# EAGLE design ov2640_module_v2 (EAGLE 5.06)
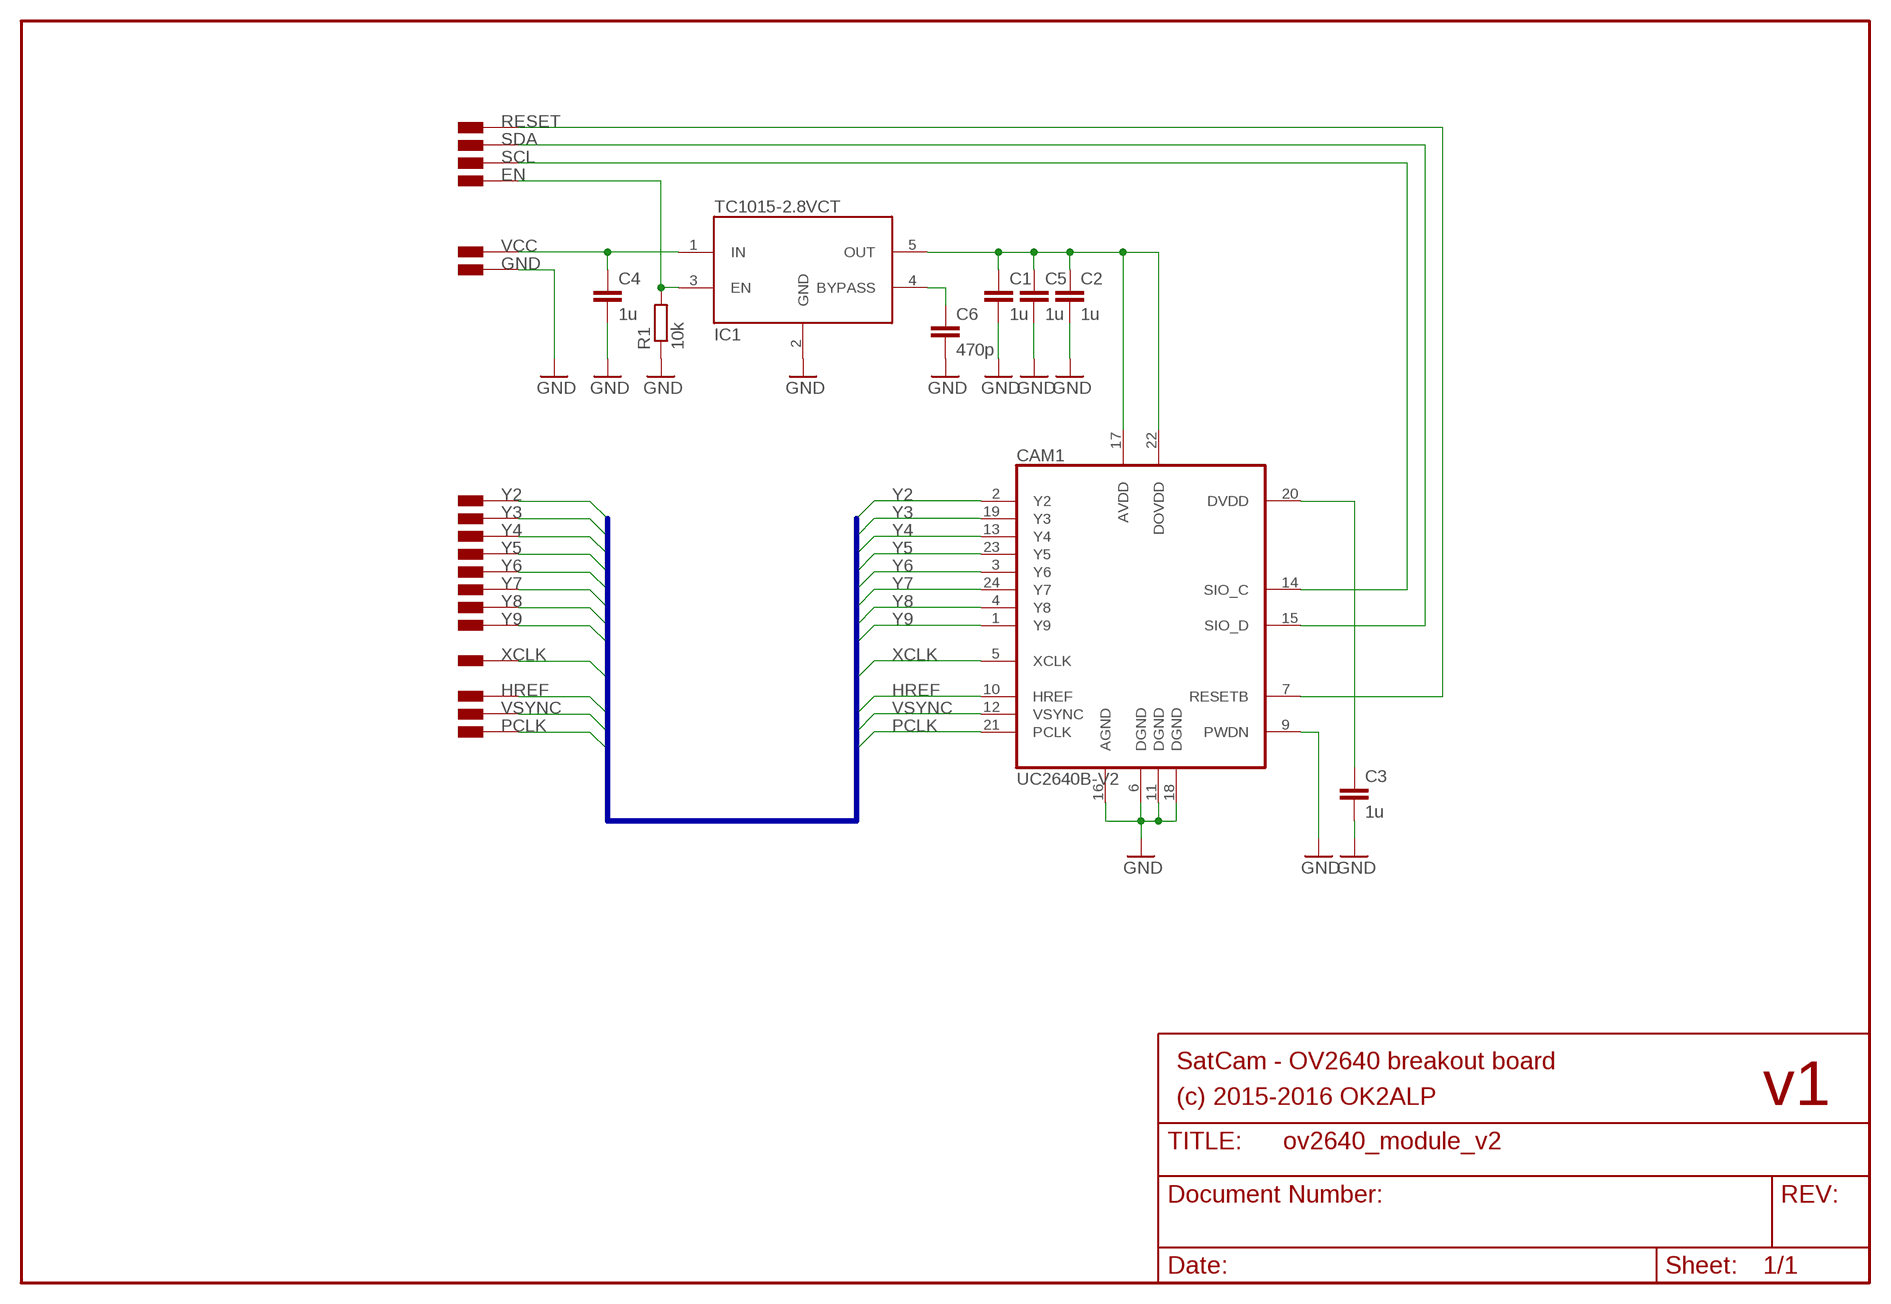
[diagram p0: schematic, sheet 1]

## Parts
C1  1u  C-EUC0603  [C0603]
C2  1u  C-EUC0603  [C0603]
C3  1u  C-EUC0603  [C0603]
C4  1u  C-EUC0603  [C0603]
C5  1u  C-EUC0603  [C0603]
C6  470p  C-EUC0603  [C0603]
CAM1  UC2640B-V2  [UC2640B2]
IC1  TC1015-2.8VCT  TC1015  [SOT23-5]
R1  10k  R-EU_R0603  [R0603]
X1  PIN-1.27-2  [PIN-1.27-2]
X2  PIN-1.27-2  [PIN-1.27-2]
X3  PIN-1.27-2  [PIN-1.27-2]
X4  PIN-1.27-2  [PIN-1.27-2]
X5  PIN-1.27-2  [PIN-1.27-2]
X6  PIN-1.27-2  [PIN-1.27-2]
X7  PIN-1.27-2  [PIN-1.27-2]
X8  PIN-1.27-2  [PIN-1.27-2]
X9  PIN-1.27-2  [PIN-1.27-2]
X10  PIN-1.27-2  [PIN-1.27-2]
X11  PIN-1.27-2  [PIN-1.27-2]
X12  PIN-1.27-2  [PIN-1.27-2]
X13  PIN-1.27-2  [PIN-1.27-2]
X14  PIN-1.27-2  [PIN-1.27-2]
X15  PIN-1.27-2  [PIN-1.27-2]
X16  PIN-1.27-2  [PIN-1.27-2]
X17  PIN-1.27-2  [PIN-1.27-2]
X20  PIN-1.27-2  [PIN-1.27-2]

## Nets
EN: IC1.3(EN) R1.2 X4.1
GND: C1.2 C2.2 C3.2 C4.2 C5.2 C6.2 CAM1.6(DGND) CAM1.9(PWDN) CAM1.11(DGND) CAM1.16(AGND) CAM1.18(DGND) IC1.2(GND) R1.1 X20.1
HREF: CAM1.10(HREF) X15.1
N$2: C3.1 CAM1.20(DVDD)
N$4: C6.1 IC1.4(BYPASS)
PCLK: CAM1.21(PCLK) X17.1
RESET: CAM1.7(RESETB) X1.1
SCL: CAM1.14(SIO_C) X3.1
SDA: CAM1.15(SIO_D) X2.1
VCAM: C1.1 C2.1 C5.1 CAM1.17(AVDD) CAM1.22(DOVDD) IC1.5(OUT)
VCC: C4.1 IC1.1(IN) X5.1
VSYNC: CAM1.12(VSYNC) X16.1
XCLK: CAM1.5(XCLK) X14.1
Y2: CAM1.2(Y2) X6.1
Y3: CAM1.19(Y3) X7.1
Y4: CAM1.13(Y4) X8.1
Y5: CAM1.23(Y5) X9.1
Y6: CAM1.3(Y6) X10.1
Y7: CAM1.24(Y7) X11.1
Y8: CAM1.4(Y8) X12.1
Y9: CAM1.1(Y9) X13.1

## Buses
Y[2..9],XCLK,HREF,VSYNC,PCLK

## Notes on the sheet
- SatCam - OV2640 breakout board
- (c) 2015-2016 OK2ALP | v1

## Library data of the parts
C1-C6 = rcl:C-EU: CAPACITOR, European symbol
CAM1 = satcam:UC2640B
IC1 = satcam:TC1015
R1 = rcl:R-EU_: RESISTOR, European symbol
X1-X17 X20 = satcam:PIN

## Board
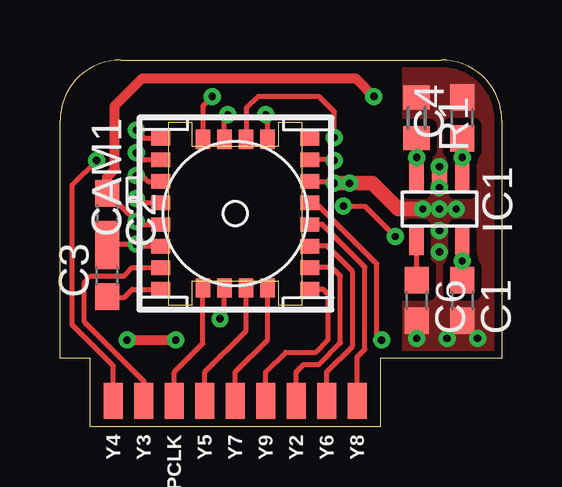
[diagram p1: board, top side]
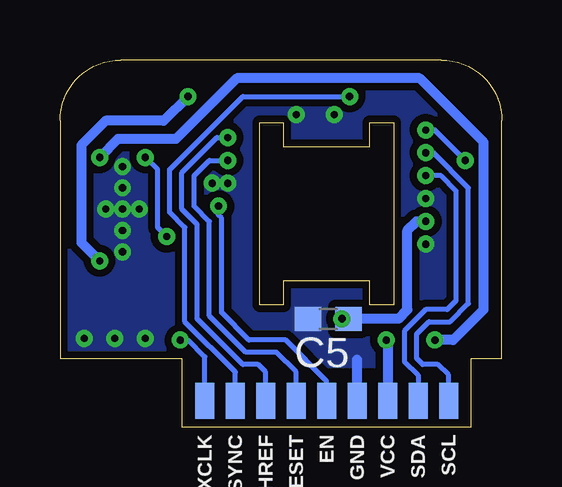
[diagram p2: board, bottom side, seen from below]

Size 18.41 x 15.3 mm. Coordinates in mm from the lower left corner, seen from the top.
Outline: 13.34,0 1.27,0 1.27,2.86 0,2.86 0,12.76 arc-90 2.54,15.3 15.88,15.3 arc-90 18.41,12.76 18.41,2.86 13.34,2.86 13.34,0
Copper layers (1*16): Top 0.035mm / dielectric 1.5mm / Bottom 0.035mm
Design rules "default *": minimum track width 8mil, minimum drill 0.3mm, track to track 0.195mm, track to pad 0.195mm, pad to pad 0.195mm, via to via 0.195mm, smd to smd 0mil, copper to edge 12mil, drill to drill 8mil, minimum pad ring 10mil, minimum via ring 8mil, stop-mask expansion 2mil, vias tented up to drill 0.5mm, thermal gap 12mil

### Footprints (pad centres in the part's own frame; a part is rotated, then mirrored left to right if it is on the bottom)
C0603 = smd 1.1 x 1: 1 -0.85,0; 2 0.85,0
UC2640B2 = smd 0.6 x 0.8: 1 3.15,3.1; 2 2.25,3.1; 3 1.35,3.1; 4 0.45,3.1; 5 -0.45,3.1; 6 -1.35,3.1; 7 -2.25,3.1; 8 -3.15,3.1; 13 -3.15,-3.1; 14 -2.25,-3.1; 15 -1.35,-3.1; 16 -0.45,-3.1; 17 0.45,-3.1; 18 1.35,-3.1; 19 2.25,-3.1; 20 3.15,-3.1 | smd 0.8 x 0.6: 9 -3.1,1.35; 10 -3.1,0.45; 11 -3.1,-0.45; 12 -3.1,-1.35; 21 3.1,-1.35; 22 3.1,-0.45; 23 3.1,0.45; 24 3.1,1.35
SOT23-5 = smd 0.6 x 1.2: 1 -0.95,-1.306; 2 0,-1.306; 3 0.95,-1.306; 4 0.95,1.306; 5 -0.95,1.306
R0603 = smd 1 x 1.1: 1 -0.85,0; 2 0.85,0
PIN-1.27-2 = smd 0.8 x 1.5: 1 0,-0.5

### Placement (x,y rotation side)
C1  16.76,5.27 270 top
C2  1.97,8.89 270 top
C3  1.97,6.29 90 top
C4  16.76,12.89 90 top
C5  7.24,4.51 180 bottom
C6  14.86,5.27 270 top
CAM1  7.3,8.89 270 top
IC1  15.81,9.08 180 top
R1  14.86,12.89 270 top
X1  8.57,1.59 0 bottom
X2  3.49,1.59 0 bottom
X3  2.22,1.59 0 bottom
X4  7.3,1.59 0 bottom
X5  4.76,1.59 0 bottom
X6  9.84,1.59 0 top
X7  3.49,1.59 0 top
X8  2.22,1.59 0 top
X9  6.03,1.59 0 top
X10  11.11,1.59 0 top
X11  7.3,1.59 0 top
X12  12.38,1.59 0 top
X13  8.57,1.59 0 top
X14  12.38,1.59 0 bottom
X15  9.84,1.59 0 bottom
X16  11.11,1.59 0 bottom
X17  4.76,1.59 0 top
X20  6.03,1.59 0 bottom

### Tracks (layer width: path | path; a pad name or v marks a point on that pad's centre or on a via)
EN  (via drill 0.3)
  Top 0.203: R1.2 14.86,11.94 IC1.3 v14.86,11.24 | v11.81,9.21 12.7,9.21 v13.97,7.94
  Bottom 0.203: v11.81,9.21 11.81,8.83 11.68,8.7 11.68,4.76 10.54,3.62 9.02,3.62 7.3,1.9 X4.1 | v14.86,11.24 14.35,10.73 14.35,8.32 v13.97,7.94
GND  (via drill 0.3)
  Top 0.203: CAM1.11 6.85,12.88 v6.99,13.02 | CAM1.9 8.65,12.94 v8.57,13.02 | CAM1.6 11.35,10.24 v11.43,10.16 | CAM1.16 3.36,9.34 v3.17,9.53 | CAM1.18 3.25,7.54 v3.17,7.62 2.22,7.62 1.91,7.94 | 1.91,7.94 1.97,8 C2.2 | C3.2 1.97,7.87 1.91,7.94
  Top 0.61: v11.43,10.16 13.02,10.16 14.1,9.08 v15.11,9.08
  Bottom 0.406: X20.1 6.03,2.79
  other vias: 15.81,9.08 15.81,9.97 16.51,9.08 17.4,3.68 14.86,3.68 16.13,3.68 15.81,8.19 12.06,10.16 15.81,10.86 15.81,7.3
  pour Bottom (isolate 0.305, no thermals): 18.29,15.24 0,15.24 0,2.54 18.29,2.54
  pour Top (isolate 0.305, no thermals): 18.29,15.24 14.35,15.24 14.35,2.86 18.29,2.86
HREF  (via drill 0.3)
  Top 0.203: v11.43,12.06 11.43,13.14 10.79,13.78 8.26,13.78 7.75,13.27 CAM1.10
  Bottom 0.203: X15.1 9.84,2.29 10.16,2.6 10.79,2.6 12.7,4.51 12.7,8.45 13.34,9.08 13.34,10.6 11.87,12.06 v11.43,12.06
N$2
  Top 0.203: CAM1.20 3.01,5.74 2.67,5.4 2.01,5.4 C3.1
N$4
  Top 0.203: C6.1 14.86,6.22 14.86,6.23 IC1.4
PCLK
  Top 0.203: CAM1.21 5.95,3.48 4.76,2.29 X17.1
RESET  (via drill 0.3)
  Top 0.203: CAM1.7 11.4,11.14 v11.43,11.11
  Bottom 0.203: 11.75,11.11 v11.43,11.11 12.19,11.11 12.83,10.48 12.83,9.21 12.19,8.57 12.19,4.64 10.67,3.11 9.4,3.11 8.57,2.29 X1.1
SCL  (via drill 0.3)
  Top 0.203: CAM1.14 3.46,11.14 v3.17,11.43
  Bottom 0.203: v3.17,11.43 2.86,11.43 1.4,9.97 1.4,5.14 2.16,4.38 3.05,4.38 3.56,3.87 3.56,2.86 3.3,2.6 2.67,2.6 2.22,2.16 X3.1
SDA  (via drill 0.3)
  Top 0.203: CAM1.15 3.67,10.24 3.43,10.48 v3.17,10.48
  Bottom 0.203: v3.17,10.48 2.54,10.48 1.91,9.84 1.91,5.27 2.29,4.89 3.17,4.89 4.06,4 4.06,2.73 3.49,2.16 X2.1
VCAM  (via drill 0.3)
  Top 0.203: CAM1.17 3.31,8.44 v3.17,8.57 1.97,9.78 | 1.97,9.78 1.91,9.84 | 1.97,9.78 C2.1 1.97,9.72 | CAM1.22 6.85,4.69 v6.67,4.51
  Top 0.254: C1.1 16.76,6.22
  Top 0.406: IC1.5 16.76,6.22 v16.76,6.92 | C2.1 1.97,10.41 2.29,10.73 2.29,13.4 3.43,14.54 12.32,14.54 v13.08,13.78
  Bottom 0.203: C5.1 v6.67,4.51
  Bottom 0.406: v3.17,8.57 3.56,8.57 3.94,8.19 3.94,4.89 4.32,4.51 C5.1 | v13.08,13.78 14.1,12.76 16.51,12.76 17.53,11.75 17.53,7.68 v16.76,6.92
VCC  (via drill 0.3)
  Top 0.254: 16.76,11.94
  Top 0.406: 16.76,11.94 IC1.1 16.76,10.35 | C4.1 16.76,11.94 v16.76,11.24 | v2.79,3.62 v4.83,3.62
  Bottom 0.406: X5.1 4.76,3.56 v4.83,3.62 | v2.79,3.62 2.03,3.62 0.76,4.89 0.76,11.87 3.43,14.54 11.05,14.54 13.59,12 16,12 v16.76,11.24
VSYNC  (via drill 0.3)
  Top 0.203: CAM1.12 5.95,13.38 v6.35,13.78
  Bottom 0.203: X16.1 11.11,2.29 13.21,4.38 13.21,8.32 13.84,8.95 13.84,10.73 10.79,13.78 v6.35,13.78
XCLK  (via drill 0.3)
  Top 0.203: CAM1.5 10.66,9.34 13.21,6.79 13.21,3.81 v13.4,3.62
  Bottom 0.203: v13.4,3.62 13.08,3.62 12.38,2.92 X14.1
Y2
  Top 0.203: X6.1 9.84,2.29 10.16,2.6 10.79,2.6 11.68,3.49 11.68,6.29 11.33,6.64 CAM1.2
Y3
  Top 0.203: X7.1 3.49,1.9 1.02,4.38 1.02,6.03 1.27,6.29 2.67,6.29 3.02,6.64 CAM1.19
Y4  (via drill 0.3)
  Top 0.203: X8.1 2.22,2.54 0.51,4.25 0.51,10.1 v1.52,11.11 | 4.06,12.13 4.15,12.04 CAM1.13 3.52,12.04 v3.17,12.38 3.43,12.13
  Bottom 0.203: v1.52,11.11 2.79,12.38 v3.17,12.38
Y5
  Top 0.203: X9.1 6.03,2.29 7.75,4.01 CAM1.23
Y6
  Top 0.203: CAM1.3 11.13,7.54 12.19,6.48 12.19,3.37 11.11,2.29 X10.1
Y7
  Top 0.203: X11.1 7.3,2.29 8.65,3.64 CAM1.24
Y8
  Top 0.203: CAM1.4 10.93,8.44 12.7,6.67 12.7,3.24 12.38,2.92 X12.1
Y9
  Top 0.203: 10.45,5.74 CAM1.1 10.96,5.74 11.18,5.52 11.18,3.62 10.67,3.11 9.4,3.11 8.57,2.29 X13.1

### Text on the board
tPlace: Y4 | Y3 | PCLK | Y5 | Y7 | Y9 | Y2 | Y6 | Y8
bPlace: SCL | SDA | VCC | GND | EN | RESET | HREF | VSYNC | XCLK
potisk: SatCam | v3 | OK2ALP